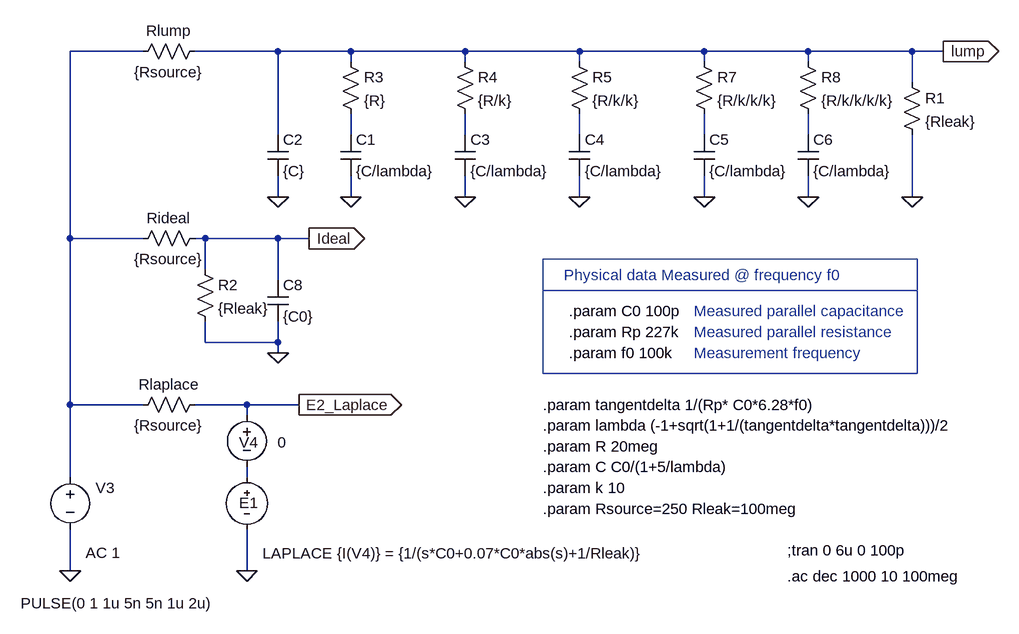
[diagram p0: schematic IdealVsLaplace.asc]
IdealVsLaplace.asc, the LTspice schematic file:
Version 4
SHEET 1 1672 1028
WIRE -64 -144 -64 -432
WIRE -64 112 -64 -144
WIRE -64 224 -64 112
WIRE -64 368 -64 304
WIRE 48 -432 -64 -432
WIRE 48 -144 -64 -144
WIRE 48 112 -64 112
WIRE 144 -144 128 -144
WIRE 144 -96 144 -144
WIRE 144 16 144 -16
WIRE 208 112 128 112
WIRE 208 128 208 112
WIRE 208 224 208 208
WIRE 208 368 208 304
WIRE 256 -432 128 -432
WIRE 256 -304 256 -432
WIRE 256 -208 256 -240
WIRE 256 -144 144 -144
WIRE 256 -80 256 -144
WIRE 256 16 144 16
WIRE 256 16 256 -16
WIRE 256 32 256 16
WIRE 288 112 208 112
WIRE 304 -144 256 -144
WIRE 368 -432 256 -432
WIRE 368 -416 368 -432
WIRE 368 -304 368 -336
WIRE 368 -208 368 -240
WIRE 544 -432 368 -432
WIRE 544 -416 544 -432
WIRE 544 -304 544 -336
WIRE 544 -208 544 -240
WIRE 720 -432 544 -432
WIRE 720 -416 720 -432
WIRE 720 -304 720 -336
WIRE 720 -208 720 -240
WIRE 912 -432 720 -432
WIRE 912 -416 912 -432
WIRE 912 -304 912 -336
WIRE 912 -208 912 -240
WIRE 1072 -432 912 -432
WIRE 1072 -416 1072 -432
WIRE 1072 -304 1072 -336
WIRE 1072 -208 1072 -240
WIRE 1232 -432 1072 -432
WIRE 1232 -384 1232 -432
WIRE 1232 -208 1232 -304
WIRE 1280 -432 1232 -432
FLAG -64 368 0
FLAG 368 -208 0
FLAG 256 -208 0
FLAG 544 -208 0
FLAG 720 -208 0
FLAG 1232 -208 0
FLAG 912 -208 0
FLAG 1072 -208 0
FLAG 256 32 0
FLAG 1280 -432 lump
IOPIN 1280 -432 Out
FLAG 208 368 0
FLAG 304 -144 Ideal
IOPIN 304 -144 Out
FLAG 288 112 E2_Laplace
IOPIN 288 112 Out
SYMBOL res 32 128 R270
WINDOW 0 32 56 VTop 0
WINDOW 3 0 56 VBottom 0
SYMATTR InstName Rlaplace
SYMATTR Value {Rsource}
SYMBOL res 352 -432 R0
SYMATTR InstName R3
SYMATTR Value {R}
SYMBOL cap 352 -304 R0
SYMATTR InstName C1
SYMATTR Value {C/lambda}
SYMBOL cap 240 -304 R0
SYMATTR InstName C2
SYMATTR Value {C}
SYMBOL res 528 -432 R0
SYMATTR InstName R4
SYMATTR Value {R/k}
SYMBOL cap 528 -304 R0
SYMATTR InstName C3
SYMATTR Value {C/lambda}
SYMBOL res 704 -432 R0
SYMATTR InstName R5
SYMATTR Value {R/k/k}
SYMBOL cap 704 -304 R0
SYMATTR InstName C4
SYMATTR Value {C/lambda}
SYMBOL res 896 -432 R0
SYMATTR InstName R7
SYMATTR Value {R/k/k/k}
SYMBOL cap 896 -304 R0
SYMATTR InstName C5
SYMATTR Value {C/lambda}
SYMBOL res 1056 -432 R0
SYMATTR InstName R8
SYMATTR Value {R/k/k/k/k}
SYMBOL cap 1056 -304 R0
SYMATTR InstName C6
SYMATTR Value {C/lambda}
SYMBOL res 32 -416 R270
WINDOW 0 32 56 VTop 0
WINDOW 3 0 56 VBottom 0
SYMATTR InstName Rlump
SYMATTR Value {Rsource}
SYMBOL res 32 -128 R270
WINDOW 0 32 56 VTop 0
WINDOW 3 0 56 VBottom 0
SYMATTR InstName Rideal
SYMATTR Value {Rsource}
SYMBOL voltage -64 208 R0
WINDOW 123 24 132 Left 0
WINDOW 39 0 0 Left 0
WINDOW 0 39 32 Left 0
WINDOW 3 -76 210 Left 0
SYMATTR Value2 AC 1
SYMATTR InstName V3
SYMATTR Value PULSE(0 1 1u 5n 5n 1u 2u)
SYMBOL cap 240 -80 R0
SYMATTR InstName C8
SYMATTR Value {C0}
SYMBOL voltage 208 112 R0
WINDOW 0 -12 58 Left 0
WINDOW 3 47 58 Left 0
SYMATTR InstName V4
SYMATTR Value 0
SYMBOL Misc\\Epoly 208 208 R0
WINDOW 0 -12 55 Left 0
WINDOW 3 24 133 Left 0
SYMATTR InstName E1
SYMATTR Value LAPLACE {I(V4)} = {1/(s*C0+0.07*C0*abs(s)+1/Rleak)}
SYMBOL res 128 -112 R0
SYMATTR InstName R2
SYMATTR Value {Rleak}
SYMBOL res 1216 -400 R0
SYMATTR InstName R1
SYMATTR Value {Rleak}
TEXT 704 -32 Left 0 !.param C0 100p
TEXT 664 112 Left 0 !.param tangentdelta 1/(Rp* C0*6.28*f0)
TEXT 664 176 Left 0 !.param R 20meg
TEXT 664 208 Left 0 !.param C C0/(1+5/lambda)
TEXT 664 240 Left 0 !.param k 10
TEXT 1040 376 Left 0 !.ac dec 1000 10 100meg
TEXT 664 144 Left 0 !.param lambda (-1+sqrt(1+1/(tangentdelta*tangentdelta)))/2
TEXT 696 -88 Left 0 ;Physical data Measured @ frequency f0
TEXT 704 0 Left 0 !.param Rp 227k
TEXT 704 32 Left 0 !.param f0 100k
TEXT 896 -32 Left 0 ;Measured parallel capacitance
TEXT 896 0 Left 0 ;Measured parallel resistance
TEXT 896 32 Left 0 ;Measurement frequency
TEXT 1040 336 Left 0 !;tran 0 6u 0 100p
TEXT 664 272 Left 0 !.param Rsource=250 Rleak=100meg
LINE Normal 1240 -64 664 -64
RECTANGLE Normal 1240 64 664 -112

The netlist it stands for:
* IdealVsLaplace.asc
Rlaplace N001 E2_Laplace {Rsource}
R3 lump N003 {R}
C1 N003 0 {C/lambda}
C2 lump 0 {C}
R4 lump N004 {R/k}
C3 N004 0 {C/lambda}
R5 lump N005 {R/k/k}
C4 N005 0 {C/lambda}
R7 lump N006 {R/k/k/k}
C5 N006 0 {C/lambda}
R8 lump N007 {R/k/k/k/k}
C6 N007 0 {C/lambda}
Rlump N001 lump {Rsource}
Rideal N001 Ideal {Rsource}
V3 N001 0 PULSE(0 1 1u 5n 5n 1u 2u) AC 1
C8 Ideal 0 {C0}
V4 E2_Laplace N002 0
E1 N002 0 LAPLACE {I(V4)} = {1/(s*C0+0.07*C0*abs(s)+1/Rleak)}
R2 Ideal 0 {Rleak}
R1 lump 0 {Rleak}
.param C0 100p
.param tangentdelta 1/(Rp* C0*6.28*f0)
.param R 20meg
.param C C0/(1+5/lambda)
.param k 10
.ac dec 1000 10 100meg
.param lambda (-1+sqrt(1+1/(tangentdelta*tangentdelta)))/2
* Physical data Measured @ frequency f0
.param Rp 227k
.param f0 100k
* Measured parallel capacitance
* Measured parallel resistance
* Measurement frequency
;tran 0 6u 0 100p
.param Rsource=250 Rleak=100meg
.backanno
.end